# Altium schematic sheet Pressure_Sensor.SchDoc
size A4
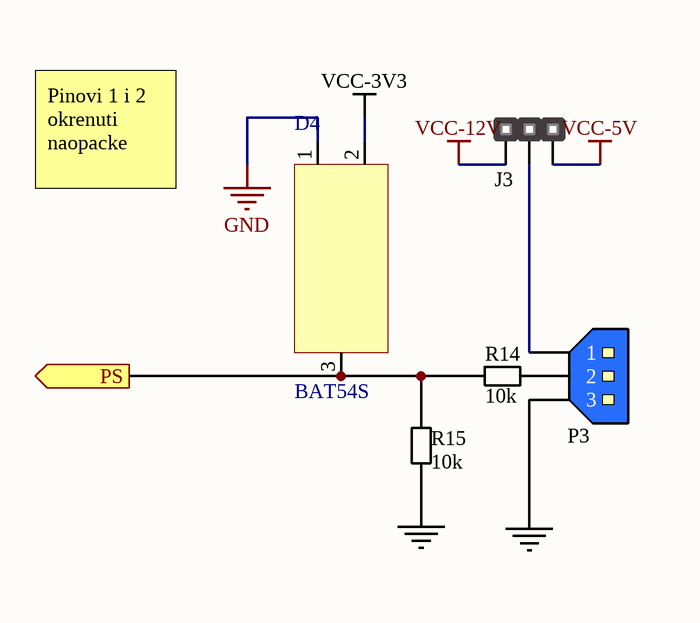
[diagram p0: Pressure_Sensor.SchDoc]

## Parts
D4  BAT54S  [BAT54S]
J3  *  [HM1X3]  (value not drawn)
P3  TE CONNECTIVITY_3PIN_MALE  [TE CONNECTIVITY_3PIN_MALE]  (value not drawn)
R14  10k  [RESC2013X38N-0805-NOOVERLAY]
R15  10k  [RESC2013X38N-0805-NOOVERLAY]

## Ports
PS (out)

## Nets
GND: P3.3 R15.1
VCC-5V: J3.3
VCC-12V: J3.1
PS: D4.3 R14.2 R15.2 ; port PS
NetJ3_2: J3.2 P3.1
NetP3_2: P3.2 R14.1

Not connected (* = marked no-connect by the designer): D4 1 2

## Notes on the sheet
- Pinovi 1 i 2 okrenuti naopacke

## Library data of the parts
J3 = HEADER_1x3: Manufacturer Part Number: *
P3 = TE CONNECTIVITY_3PIN_MALE: BLUE_3PIN_CONECTOR; Manufacturer: TE CONNECTIVITY / AMP; Manufacturer Part Number 1: 281695-3; Order Code 1: 1205983; Price 1: £0.403; Supplier 1: uk.farnell.com
R14 R15 = 000001002: RES SMD 10 kOhm 1/8W 0805; Resistance: 10k